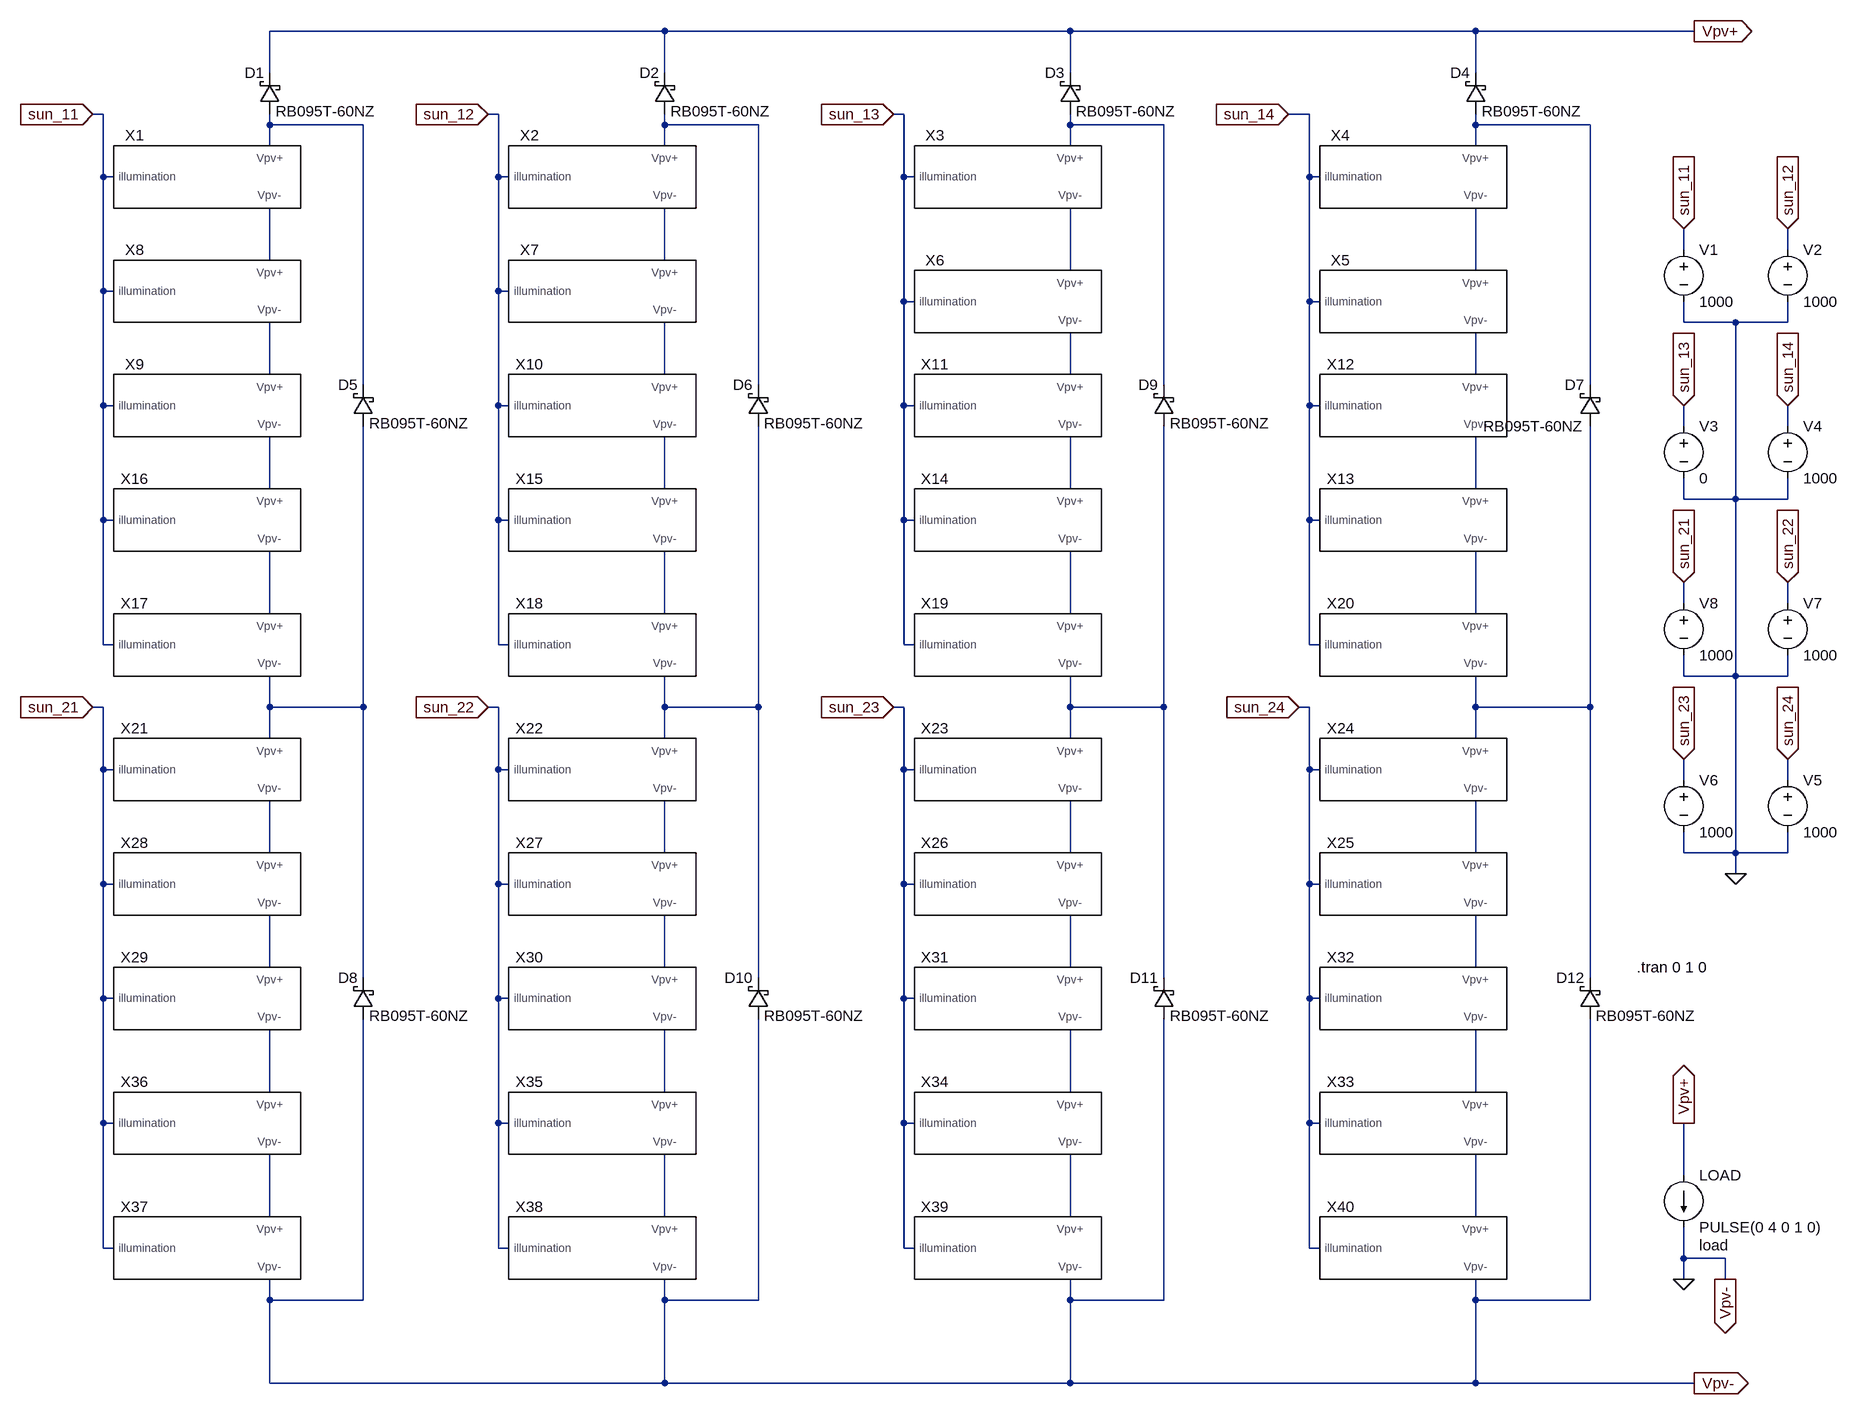
[diagram p0: schematic pannello_40Celle_v1-testing.asc]
pannello_40Celle_v1-testing.asc, the LTspice schematic file:
Version 4
SHEET 1 3240 2012
WIRE 272 -160 -336 -160
WIRE 896 -160 272 -160
WIRE 1520 -160 896 -160
WIRE 1856 -160 1520 -160
WIRE -336 -96 -336 -160
WIRE 272 -96 272 -160
WIRE 896 -96 896 -160
WIRE 1520 -96 1520 -160
WIRE -592 -32 -608 -32
WIRE 16 -32 0 -32
WIRE 640 -32 624 -32
WIRE 1264 -32 1232 -32
WIRE -336 -16 -336 -32
WIRE -192 -16 -336 -16
WIRE 272 -16 272 -32
WIRE 416 -16 272 -16
WIRE 896 -16 896 -32
WIRE 1040 -16 896 -16
WIRE 1520 -16 1520 -32
WIRE 1696 -16 1520 -16
WIRE -336 16 -336 -16
WIRE 272 16 272 -16
WIRE 896 16 896 -16
WIRE 1520 16 1520 -16
WIRE -592 64 -592 -32
WIRE -576 64 -592 64
WIRE 16 64 16 -32
WIRE 32 64 16 64
WIRE 640 64 640 -32
WIRE 656 64 640 64
WIRE 1264 64 1264 -32
WIRE 1280 64 1264 64
WIRE 1840 176 1840 144
WIRE 2000 176 2000 144
WIRE -336 192 -336 112
WIRE 272 192 272 112
WIRE 896 208 896 112
WIRE 1520 208 1520 112
WIRE -592 240 -592 64
WIRE -576 240 -592 240
WIRE 16 240 16 64
WIRE 32 240 16 240
WIRE 640 256 640 64
WIRE 656 256 640 256
WIRE 1264 256 1264 64
WIRE 1280 256 1264 256
WIRE 1840 288 1840 256
WIRE 1920 288 1840 288
WIRE 2000 288 2000 256
WIRE 2000 288 1920 288
WIRE -336 368 -336 288
WIRE 272 368 272 288
WIRE 896 368 896 304
WIRE 1520 368 1520 304
WIRE -192 384 -192 -16
WIRE 416 384 416 -16
WIRE 1040 384 1040 -16
WIRE 1696 384 1696 -16
WIRE -592 416 -592 240
WIRE -576 416 -592 416
WIRE 16 416 16 240
WIRE 32 416 16 416
WIRE 640 416 640 256
WIRE 656 416 640 416
WIRE 1264 416 1264 256
WIRE 1280 416 1264 416
WIRE 1840 448 1840 416
WIRE 2000 448 2000 416
WIRE -336 544 -336 464
WIRE 272 544 272 464
WIRE 896 544 896 464
WIRE 1520 544 1520 464
WIRE 1840 560 1840 528
WIRE 1920 560 1920 288
WIRE 1920 560 1840 560
WIRE 2000 560 2000 528
WIRE 2000 560 1920 560
WIRE -592 592 -592 416
WIRE -576 592 -592 592
WIRE 16 592 16 416
WIRE 32 592 16 592
WIRE 640 592 640 416
WIRE 656 592 640 592
WIRE 1264 592 1264 416
WIRE 1280 592 1264 592
WIRE 1840 720 1840 688
WIRE 2000 720 2000 688
WIRE -336 736 -336 640
WIRE 272 736 272 640
WIRE 896 736 896 640
WIRE 1520 736 1520 640
WIRE -592 784 -592 592
WIRE -576 784 -592 784
WIRE 16 784 16 592
WIRE 32 784 16 784
WIRE 640 784 640 592
WIRE 656 784 640 784
WIRE 1264 784 1264 592
WIRE 1280 784 1264 784
WIRE 1840 832 1840 800
WIRE 1920 832 1920 560
WIRE 1920 832 1840 832
WIRE 2000 832 2000 800
WIRE 2000 832 1920 832
WIRE -592 880 -608 880
WIRE -336 880 -336 832
WIRE -192 880 -192 448
WIRE -192 880 -336 880
WIRE 16 880 0 880
WIRE 272 880 272 832
WIRE 416 880 416 448
WIRE 416 880 272 880
WIRE 640 880 624 880
WIRE 896 880 896 832
WIRE 1040 880 1040 448
WIRE 1040 880 896 880
WIRE 1264 880 1248 880
WIRE 1520 880 1520 832
WIRE 1696 880 1696 448
WIRE 1696 880 1520 880
WIRE -336 928 -336 880
WIRE 272 928 272 880
WIRE 896 928 896 880
WIRE 1520 928 1520 880
WIRE -592 976 -592 880
WIRE -576 976 -592 976
WIRE 16 976 16 880
WIRE 32 976 16 976
WIRE 640 976 640 880
WIRE 656 976 640 976
WIRE 1264 976 1264 880
WIRE 1280 976 1264 976
WIRE 1840 992 1840 960
WIRE 2000 992 2000 960
WIRE -336 1104 -336 1024
WIRE 272 1104 272 1024
WIRE 896 1104 896 1024
WIRE 1520 1104 1520 1024
WIRE 1840 1104 1840 1072
WIRE 1920 1104 1920 832
WIRE 1920 1104 1840 1104
WIRE 2000 1104 2000 1072
WIRE 2000 1104 1920 1104
WIRE 1920 1136 1920 1104
WIRE -592 1152 -592 976
WIRE -576 1152 -592 1152
WIRE 16 1152 16 976
WIRE 32 1152 16 1152
WIRE 640 1152 640 976
WIRE 656 1152 640 1152
WIRE 1264 1152 1264 976
WIRE 1280 1152 1264 1152
WIRE -336 1280 -336 1200
WIRE 272 1280 272 1200
WIRE 896 1280 896 1200
WIRE 1520 1280 1520 1200
WIRE -192 1296 -192 880
WIRE 416 1296 416 880
WIRE 1040 1296 1040 880
WIRE 1696 1296 1696 880
WIRE -592 1328 -592 1152
WIRE -576 1328 -592 1328
WIRE 16 1328 16 1152
WIRE 32 1328 16 1328
WIRE 640 1328 640 1152
WIRE 656 1328 640 1328
WIRE 1264 1328 1264 1152
WIRE 1280 1328 1264 1328
WIRE -336 1472 -336 1376
WIRE 272 1472 272 1376
WIRE 896 1472 896 1376
WIRE 1520 1472 1520 1376
WIRE -592 1520 -592 1328
WIRE -576 1520 -592 1520
WIRE 16 1520 16 1328
WIRE 32 1520 16 1520
WIRE 640 1520 640 1328
WIRE 656 1520 640 1520
WIRE 1264 1520 1264 1328
WIRE 1280 1520 1264 1520
WIRE 1840 1600 1840 1520
WIRE -336 1664 -336 1568
WIRE 272 1664 272 1568
WIRE 896 1664 896 1568
WIRE 1520 1664 1520 1568
WIRE -592 1712 -592 1520
WIRE -576 1712 -592 1712
WIRE 16 1712 16 1520
WIRE 32 1712 16 1712
WIRE 640 1712 640 1520
WIRE 656 1712 640 1712
WIRE 1264 1712 1264 1520
WIRE 1280 1712 1264 1712
WIRE 1840 1728 1840 1680
WIRE 1904 1728 1840 1728
WIRE 1840 1760 1840 1728
WIRE 1904 1760 1904 1728
WIRE -336 1792 -336 1760
WIRE -192 1792 -192 1360
WIRE -192 1792 -336 1792
WIRE 272 1792 272 1760
WIRE 416 1792 416 1360
WIRE 416 1792 272 1792
WIRE 896 1792 896 1760
WIRE 1040 1792 1040 1360
WIRE 1040 1792 896 1792
WIRE 1520 1792 1520 1760
WIRE 1696 1792 1696 1360
WIRE 1696 1792 1520 1792
WIRE -336 1920 -336 1792
WIRE 272 1920 272 1792
WIRE 272 1920 -336 1920
WIRE 896 1920 896 1792
WIRE 896 1920 272 1920
WIRE 1520 1920 1520 1792
WIRE 1520 1920 896 1920
WIRE 1856 1920 1520 1920
FLAG 1856 -160 Vpv+
IOPIN 1856 -160 Out
FLAG 1856 1920 Vpv-
IOPIN 1856 1920 Out
FLAG -608 -32 sun_11
IOPIN -608 -32 In
FLAG -608 880 sun_21
IOPIN -608 880 In
FLAG 0 -32 sun_12
IOPIN 0 -32 In
FLAG 0 880 sun_22
IOPIN 0 880 In
FLAG 624 -32 sun_13
IOPIN 624 -32 In
FLAG 624 880 sun_23
IOPIN 624 880 In
FLAG 1248 880 sun_24
IOPIN 1248 880 In
FLAG 1232 -32 sun_14
IOPIN 1232 -32 In
FLAG 1840 144 sun_11
IOPIN 1840 144 In
FLAG 1840 688 sun_21
IOPIN 1840 688 In
FLAG 2000 144 sun_12
IOPIN 2000 144 In
FLAG 1840 416 sun_13
IOPIN 1840 416 In
FLAG 2000 416 sun_14
IOPIN 2000 416 In
FLAG 2000 688 sun_22
IOPIN 2000 688 In
FLAG 1840 960 sun_23
IOPIN 1840 960 In
FLAG 2000 960 sun_24
IOPIN 2000 960 In
FLAG 1920 1136 0
FLAG 1840 1520 Vpv+
IOPIN 1840 1520 Out
FLAG 1904 1760 Vpv-
IOPIN 1904 1760 Out
FLAG 1840 1760 0
SYMBOL CellaFotovoltaica -400 64 R0
SYMATTR InstName X1
SYMBOL CellaFotovoltaica 208 64 R0
SYMATTR InstName X2
SYMBOL CellaFotovoltaica 832 64 R0
SYMATTR InstName X3
SYMBOL CellaFotovoltaica 1456 64 R0
SYMATTR InstName X4
SYMBOL CellaFotovoltaica 1456 256 R0
SYMATTR InstName X5
SYMBOL CellaFotovoltaica 832 256 R0
SYMATTR InstName X6
SYMBOL CellaFotovoltaica 208 240 R0
SYMATTR InstName X7
SYMBOL CellaFotovoltaica -400 240 R0
SYMATTR InstName X8
SYMBOL CellaFotovoltaica -400 416 R0
SYMATTR InstName X9
SYMBOL CellaFotovoltaica 208 416 R0
SYMATTR InstName X10
SYMBOL CellaFotovoltaica 832 416 R0
SYMATTR InstName X11
SYMBOL CellaFotovoltaica 1456 416 R0
SYMATTR InstName X12
SYMBOL CellaFotovoltaica 1456 592 R0
SYMATTR InstName X13
SYMBOL CellaFotovoltaica 832 592 R0
SYMATTR InstName X14
SYMBOL CellaFotovoltaica 208 592 R0
SYMATTR InstName X15
SYMBOL CellaFotovoltaica -400 592 R0
SYMATTR InstName X16
SYMBOL CellaFotovoltaica -400 784 R0
SYMATTR InstName X17
SYMBOL CellaFotovoltaica 208 784 R0
SYMATTR InstName X18
SYMBOL CellaFotovoltaica 832 784 R0
SYMATTR InstName X19
SYMBOL CellaFotovoltaica 1456 784 R0
SYMATTR InstName X20
SYMBOL CellaFotovoltaica -400 976 R0
SYMATTR InstName X21
SYMBOL CellaFotovoltaica 208 976 R0
SYMATTR InstName X22
SYMBOL CellaFotovoltaica 832 976 R0
SYMATTR InstName X23
SYMBOL CellaFotovoltaica 1456 976 R0
SYMATTR InstName X24
SYMBOL CellaFotovoltaica 1456 1152 R0
SYMATTR InstName X25
SYMBOL CellaFotovoltaica 832 1152 R0
SYMATTR InstName X26
SYMBOL CellaFotovoltaica 208 1152 R0
SYMATTR InstName X27
SYMBOL CellaFotovoltaica -400 1152 R0
SYMATTR InstName X28
SYMBOL CellaFotovoltaica -400 1328 R0
SYMATTR InstName X29
SYMBOL CellaFotovoltaica 208 1328 R0
SYMATTR InstName X30
SYMBOL CellaFotovoltaica 832 1328 R0
SYMATTR InstName X31
SYMBOL CellaFotovoltaica 1456 1328 R0
SYMATTR InstName X32
SYMBOL CellaFotovoltaica 1456 1520 R0
SYMATTR InstName X33
SYMBOL CellaFotovoltaica 832 1520 R0
SYMATTR InstName X34
SYMBOL CellaFotovoltaica 208 1520 R0
SYMATTR InstName X35
SYMBOL CellaFotovoltaica -400 1520 R0
SYMATTR InstName X36
SYMBOL CellaFotovoltaica -400 1712 R0
SYMATTR InstName X37
SYMBOL CellaFotovoltaica 208 1712 R0
SYMATTR InstName X38
SYMBOL CellaFotovoltaica 832 1712 R0
SYMATTR InstName X39
SYMBOL CellaFotovoltaica 1456 1712 R0
SYMATTR InstName X40
SYMBOL schottky 1056 448 R180
WINDOW 0 24 64 Left 2
WINDOW 3 -149 5 Left 2
SYMATTR InstName D9
SYMATTR Value RB095T-60NZ
SYMATTR Description Diode
SYMATTR Type diode
SYMBOL schottky -320 -32 R180
WINDOW 0 24 64 Left 2
WINDOW 3 -149 5 Left 2
SYMATTR InstName D1
SYMATTR Value RB095T-60NZ
SYMATTR Description Diode
SYMATTR Type diode
SYMBOL schottky 288 -32 R180
WINDOW 0 24 64 Left 2
WINDOW 3 -149 5 Left 2
SYMATTR InstName D2
SYMATTR Value RB095T-60NZ
SYMATTR Description Diode
SYMATTR Type diode
SYMBOL schottky 912 -32 R180
WINDOW 0 24 64 Left 2
WINDOW 3 -149 5 Left 2
SYMATTR InstName D3
SYMATTR Value RB095T-60NZ
SYMATTR Description Diode
SYMATTR Type diode
SYMBOL schottky 1536 -32 R180
WINDOW 0 24 64 Left 2
WINDOW 3 -149 5 Left 2
SYMATTR InstName D4
SYMATTR Value RB095T-60NZ
SYMATTR Description Diode
SYMATTR Type diode
SYMBOL schottky -176 448 R180
WINDOW 0 24 64 Left 2
WINDOW 3 -149 5 Left 2
SYMATTR InstName D5
SYMATTR Value RB095T-60NZ
SYMATTR Description Diode
SYMATTR Type diode
SYMBOL schottky 432 448 R180
WINDOW 0 24 64 Left 2
WINDOW 3 -149 5 Left 2
SYMATTR InstName D6
SYMATTR Value RB095T-60NZ
SYMATTR Description Diode
SYMATTR Type diode
SYMBOL schottky 1712 448 R180
WINDOW 0 24 64 Left 2
WINDOW 3 24 0 Left 2
SYMATTR InstName D7
SYMATTR Value RB095T-60NZ
SYMATTR Description Diode
SYMATTR Type diode
SYMBOL schottky -176 1360 R180
WINDOW 0 24 64 Left 2
WINDOW 3 -149 5 Left 2
SYMATTR InstName D8
SYMATTR Value RB095T-60NZ
SYMATTR Description Diode
SYMATTR Type diode
SYMBOL schottky 432 1360 R180
WINDOW 0 24 64 Left 2
WINDOW 3 -149 5 Left 2
SYMATTR InstName D10
SYMATTR Value RB095T-60NZ
SYMATTR Description Diode
SYMATTR Type diode
SYMBOL schottky 1056 1360 R180
WINDOW 0 24 64 Left 2
WINDOW 3 -149 5 Left 2
SYMATTR InstName D11
SYMATTR Value RB095T-60NZ
SYMATTR Description Diode
SYMATTR Type diode
SYMBOL schottky 1712 1360 R180
WINDOW 0 24 64 Left 2
WINDOW 3 -149 5 Left 2
SYMATTR InstName D12
SYMATTR Value RB095T-60NZ
SYMATTR Description Diode
SYMATTR Type diode
SYMBOL voltage 1840 160 R0
SYMATTR InstName V1
SYMATTR Value 1000
SYMBOL voltage 2000 160 R0
SYMATTR InstName V2
SYMATTR Value 1000
SYMBOL voltage 1840 432 R0
WINDOW 123 0 0 Left 0
WINDOW 39 0 0 Left 0
SYMATTR InstName V3
SYMATTR Value 0
SYMBOL voltage 2000 432 R0
SYMATTR InstName V4
SYMATTR Value 1000
SYMBOL voltage 2000 976 R0
WINDOW 123 0 0 Left 0
WINDOW 39 0 0 Left 0
SYMATTR InstName V5
SYMATTR Value 1000
SYMBOL voltage 1840 976 R0
SYMATTR InstName V6
SYMATTR Value 1000
SYMBOL voltage 2000 704 R0
SYMATTR InstName V7
SYMATTR Value 1000
SYMBOL voltage 1840 704 R0
SYMATTR InstName V8
SYMATTR Value 1000
SYMBOL current 1840 1600 R0
WINDOW 123 0 0 Left 0
WINDOW 39 24 108 Left 2
SYMATTR SpiceLine load
SYMATTR InstName LOAD
SYMATTR Value PULSE(0 4 0 1 0)
TEXT 1768 1280 Left 2 !.tran 0 1 0

The netlist it stands for:
* pannello_40Celle_v1-testing.asc
XX1 sun_11 N001 N005 CellaFotovoltaica  ; pins illumination Vpv+ Vpv-
XX2 sun_12 N002 N006 CellaFotovoltaica  ; pins illumination Vpv+ Vpv-
XX3 sun_13 N003 N007 CellaFotovoltaica  ; pins illumination Vpv+ Vpv-
XX4 sun_14 N004 N008 CellaFotovoltaica  ; pins illumination Vpv+ Vpv-
XX5 sun_14 N008 N012 CellaFotovoltaica  ; pins illumination Vpv+ Vpv-
XX6 sun_13 N007 N011 CellaFotovoltaica  ; pins illumination Vpv+ Vpv-
XX7 sun_12 N006 N010 CellaFotovoltaica  ; pins illumination Vpv+ Vpv-
XX8 sun_11 N005 N009 CellaFotovoltaica  ; pins illumination Vpv+ Vpv-
XX9 sun_11 N009 N013 CellaFotovoltaica  ; pins illumination Vpv+ Vpv-
XX10 sun_12 N010 N014 CellaFotovoltaica  ; pins illumination Vpv+ Vpv-
XX11 sun_13 N011 N015 CellaFotovoltaica  ; pins illumination Vpv+ Vpv-
XX12 sun_14 N012 N016 CellaFotovoltaica  ; pins illumination Vpv+ Vpv-
XX13 sun_14 N016 N020 CellaFotovoltaica  ; pins illumination Vpv+ Vpv-
XX14 sun_13 N015 N019 CellaFotovoltaica  ; pins illumination Vpv+ Vpv-
XX15 sun_12 N014 N018 CellaFotovoltaica  ; pins illumination Vpv+ Vpv-
XX16 sun_11 N013 N017 CellaFotovoltaica  ; pins illumination Vpv+ Vpv-
XX17 sun_11 N017 N021 CellaFotovoltaica  ; pins illumination Vpv+ Vpv-
XX18 sun_12 N018 N022 CellaFotovoltaica  ; pins illumination Vpv+ Vpv-
XX19 sun_13 N019 N023 CellaFotovoltaica  ; pins illumination Vpv+ Vpv-
XX20 sun_14 N020 N024 CellaFotovoltaica  ; pins illumination Vpv+ Vpv-
XX21 sun_21 N021 N025 CellaFotovoltaica  ; pins illumination Vpv+ Vpv-
XX22 sun_22 N022 N026 CellaFotovoltaica  ; pins illumination Vpv+ Vpv-
XX23 sun_23 N023 N027 CellaFotovoltaica  ; pins illumination Vpv+ Vpv-
XX24 sun_24 N024 N028 CellaFotovoltaica  ; pins illumination Vpv+ Vpv-
XX25 sun_24 N028 N032 CellaFotovoltaica  ; pins illumination Vpv+ Vpv-
XX26 sun_23 N027 N031 CellaFotovoltaica  ; pins illumination Vpv+ Vpv-
XX27 sun_22 N026 N030 CellaFotovoltaica  ; pins illumination Vpv+ Vpv-
XX28 sun_21 N025 N029 CellaFotovoltaica  ; pins illumination Vpv+ Vpv-
XX29 sun_21 N029 N033 CellaFotovoltaica  ; pins illumination Vpv+ Vpv-
XX30 sun_22 N030 N034 CellaFotovoltaica  ; pins illumination Vpv+ Vpv-
XX31 sun_23 N031 N035 CellaFotovoltaica  ; pins illumination Vpv+ Vpv-
XX32 sun_24 N032 N036 CellaFotovoltaica  ; pins illumination Vpv+ Vpv-
XX33 sun_24 N036 N040 CellaFotovoltaica  ; pins illumination Vpv+ Vpv-
XX34 sun_23 N035 N039 CellaFotovoltaica  ; pins illumination Vpv+ Vpv-
XX35 sun_22 N034 N038 CellaFotovoltaica  ; pins illumination Vpv+ Vpv-
XX36 sun_21 N033 N037 CellaFotovoltaica  ; pins illumination Vpv+ Vpv-
XX37 sun_21 N037 0 CellaFotovoltaica  ; pins illumination Vpv+ Vpv-
XX38 sun_22 N038 0 CellaFotovoltaica  ; pins illumination Vpv+ Vpv-
XX39 sun_23 N039 0 CellaFotovoltaica  ; pins illumination Vpv+ Vpv-
XX40 sun_24 N040 0 CellaFotovoltaica  ; pins illumination Vpv+ Vpv-
D9 N023 N003 RB095T-60NZ
D1 N001 Vpv+ RB095T-60NZ
D2 N002 Vpv+ RB095T-60NZ
D3 N003 Vpv+ RB095T-60NZ
D4 N004 Vpv+ RB095T-60NZ
D5 N021 N001 RB095T-60NZ
D6 N022 N002 RB095T-60NZ
D7 N024 N004 RB095T-60NZ
D8 0 N021 RB095T-60NZ
D10 0 N022 RB095T-60NZ
D11 0 N023 RB095T-60NZ
D12 0 N024 RB095T-60NZ
V1 sun_11 0 1000
V2 sun_12 0 1000
V3 sun_13 0 0
V4 sun_14 0 1000
V5 sun_24 0 1000
V6 sun_23 0 1000
V7 sun_22 0 1000
V8 sun_21 0 1000
I§LOAD Vpv+ 0 PULSE(0 4 0 1 0) load
.model D D
.lib standard.dio
.tran 0 1 0
.backanno
.end